# EAGLE design um66t (EAGLE 9.3.0)
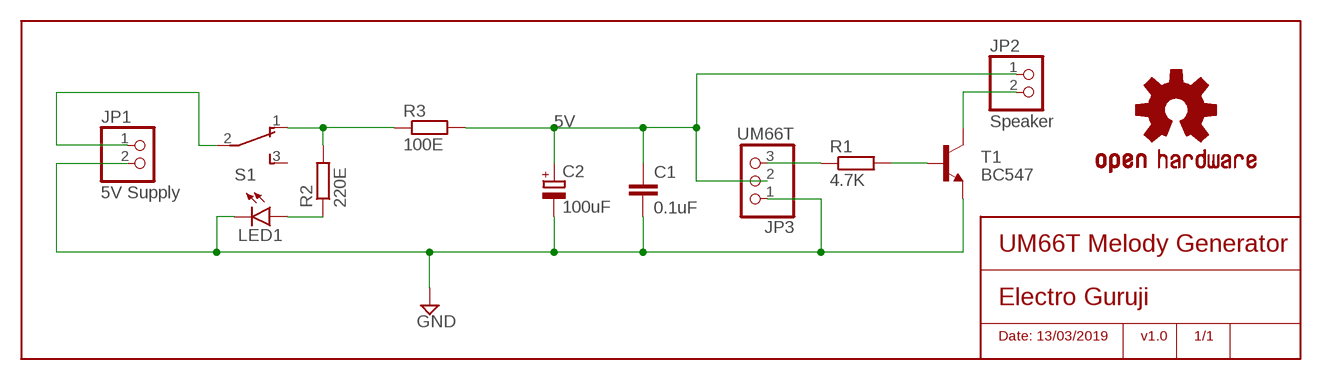
[diagram p0: schematic, sheet 1]

## Parts
C1  0.1uF  C-EU025-024X044  [C025-024X044]
C2  100uF  CPOL-EUE5-5  [E5-5]
JP1  5V Supply  PINHD-1X2  [1X02]
JP2  Speaker  PINHD-1X2  [1X02]
JP3  UM66T  PINHD-1X3  [1X03]
LED1  LED5MM  [LED5MM]
LOGO1  OSHW-LOGOM-COPPER  [OSHW-LOGO-M_COPPER]
R1  4.7K  R-EU_0204/5  [0204/5]
R2  220E  R-EU_0204/5  [0204/5]
R3  100E  R-EU_0204/5  [0204/5]
S1  SPDT  TL36YO  [TL3XYO]
T1  BC547  BC237-NPN-TO92-CBE  [TO92-CBE]

## Nets
5V: C1.1 C2.+ JP2.1 JP3.2 R3.2
9V: JP1.1 S1.2(P)
GND: C1.2 C2.- JP1.2 JP3.1 LED1.K(C) T1.E
N$1: LED1.A R2.1
N$2: R2.2 R3.1 S1.1(O)
N$5: JP3.3 R1.1
N$6: R1.2 T1.B
N$7: JP2.2 T1.C
Unconnected: S1.3(S)

## Notes on the sheet
- UM66T Melody Generator
- Electro Guruji
- Date: 13/03/2019 | v1.0 | 1/1

## Library data of the parts
C1 = resistor:C-EU: CAPACITOR, European symbol
C2 = resistor:CPOL-EU: POLARIZED CAPACITOR, European symbol
JP1 JP2 = pinhead:PINHD-1X2: PIN HEADER
JP3 = pinhead:PINHD-1X3: PIN HEADER
LED1 = led:LED: LED OSRAM: - CHIPLED LG R971, LG N971, LY N971, LG Q971, LY Q971, LO R971, LY R971 LH N974, LH R974 LS Q976, LO Q976, LY Q976 LO Q996 - Hyper CHIPLED LW Q18S LB Q993, LB Q99A, LB R99A - SideLED LS A670, LO A670, LY A670, LG A670, LP A670 LB A673, LV A673, LT A673, LW A673 LH A674 LY A675 LS A676, LA A676, LO A676, LY A676, LW A676 LS A679, LY A679, LG A679 - Hyper Micro SIDELED® LS Y876, LA Y876, LO Y876, LY Y876 LT Y87S - SmartLED LW L88C, LW L88S LB L89C, LB L89S, LG L890 LS L89K, LO L89K, LY L89K LS L896, LA L896, LO L896, LY L896 - TOPLED LS T670, LO T670, LY T670, LG T670, LP T670 LSG T670, LSP T670, LSY T670, LOP T670, LYG T670 LG T671, LOG T671, LSG T671 LB T673, LV T673, LT T673, LW T673 LH T674 LS T676, LA T676, LO T676, LY T676, LB T676, LH T676, LSB T676, LW T676 LB T67C, LV T67C, LT T67C, LS T67K, LO T67K, LY T67K, LW E67C LS E67B, LA E67B, LO E67B, LY E67B, LB E67C, LV E67C, LT E67C LW T67C LS T679, LY T679, LG T679 LS T770, LO T770, LY T770, LG T770, LP T770 LB T773, LV T773, LT T773, LW T773 LH T774 LS E675, LA E675, LY E675, LS T675 LS T776, LA T776, LO T776, LY T776, LB T776 LHGB T686 LT T68C, LB T68C - Hyper Mini TOPLED® LB M676 - Mini TOPLED Santana® LG M470 LS M47K, LO M47K, LY M47K Source: http://www.osram.convergy.de LUXEON: - LUMILED® LXK2-PW12-R00, LXK2-PW12-S00, LXK2-PW14-U00, LXK2-PW14-V00 LXK2-PM12-R00, LXK2-PM12-S00, LXK2-PM14-U00 LXK2-PE12-Q00, LXK2-PE12-R00, LXK2-PE12-S00, LXK2-PE14-T00, LXK2-PE14-U00 LXK2-PB12-K00, LXK2-PB12-L00, LXK2-PB12-M00, LXK2-PB14-N00, LXK2-PB14-P00, LXK2-PB14-Q00 LXK2-PR12-L00, LXK2-PR12-M00, LXK2-PR14-Q00, LXK2-PR14-R00 LXK2-PD12-Q00, LXK2-PD12-R00, LXK2-PD12-S00 LXK2-PH12-R00, LXK2-PH12-S00 LXK2-PL12-P00, LXK2-PL12-Q00, LXK2-PL12-R00 Source: www.luxeon.com KINGBRIGHT: KA-3528ASYC Source: www.kingbright.com
LOGO1 = SparkFun-Aesthetics:OSHW-LOGO: Open-Source Hardware (OSHW) Logo This logo indicates the piece of hardware it is found on incorporates a OSHW license and/or adheres to the definition of open source hardware found here: http://freedomdefined.org/OSHW
R1-R3 = resistor:R-EU_: RESISTOR, European symbol
S1 = switch:TL36YO: TINY SWITCH ON - ON Source: http://www2.produktinfo.conrad.com/datenblaetter/700000-724999/705152-da-01-de-Subminiaturschalter_TL_36YO.pdf
T1 = transistor:*-NPN-: NPN Transistror BF959 corrected 2008.03.06

## Board
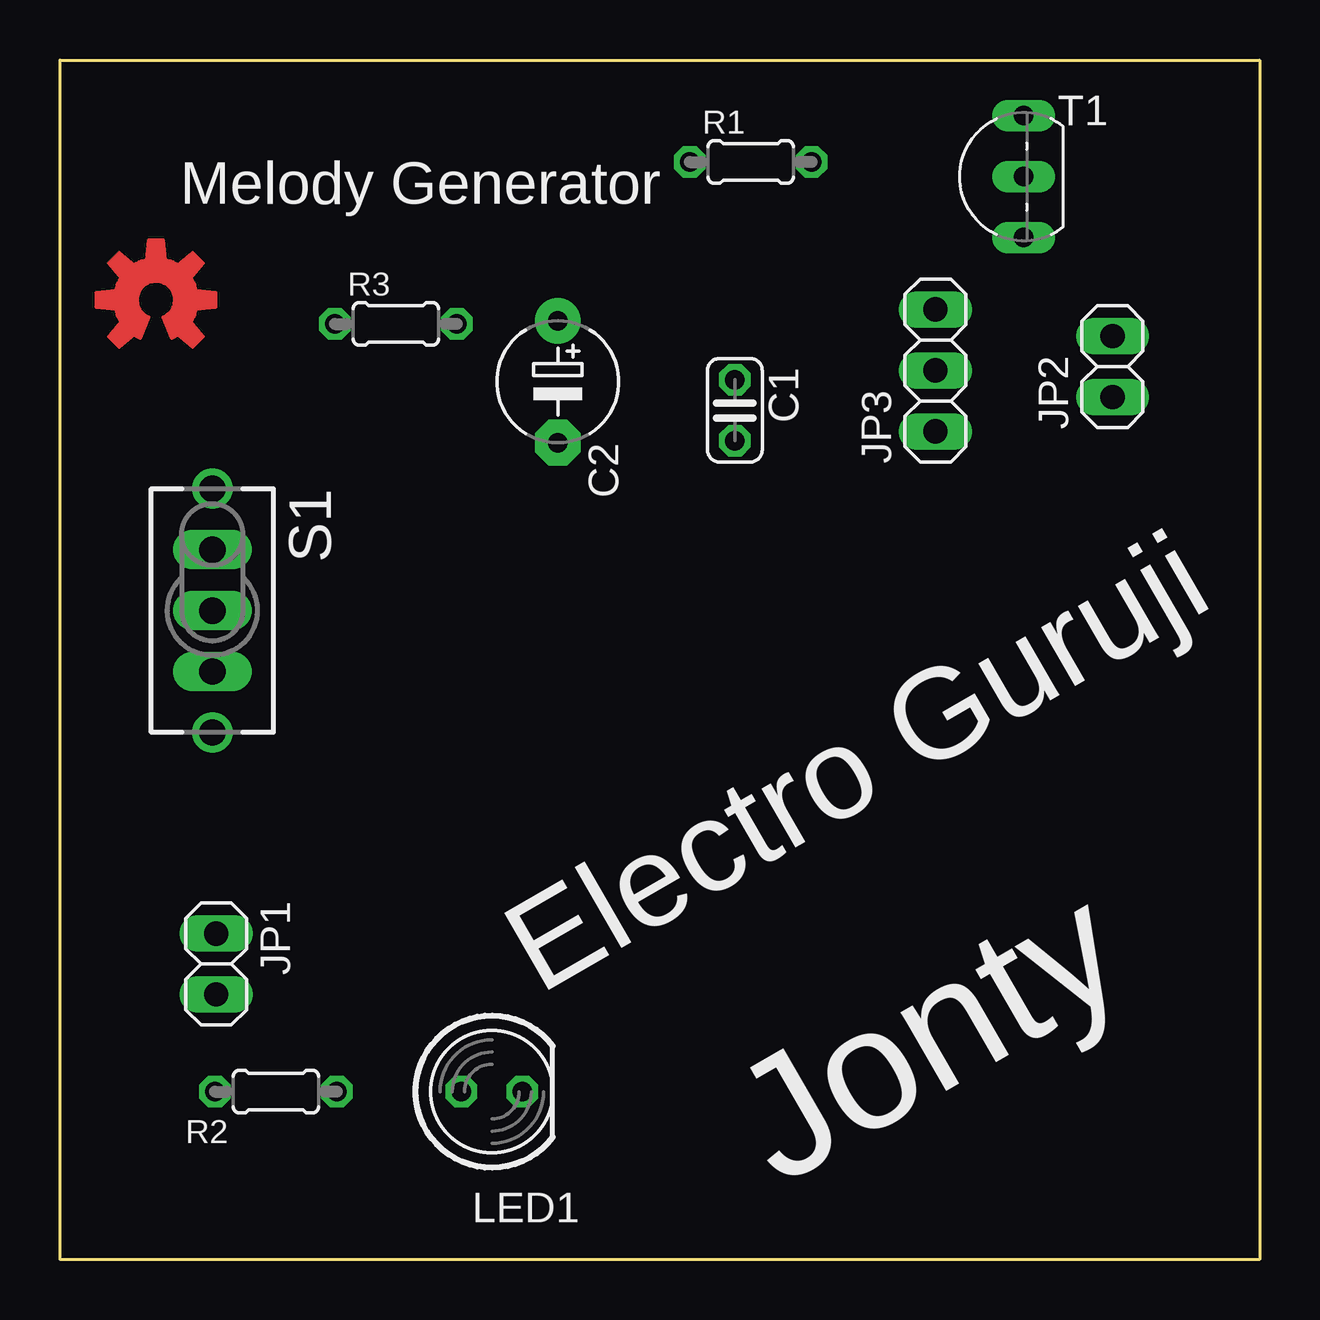
[diagram p1: board, top side]
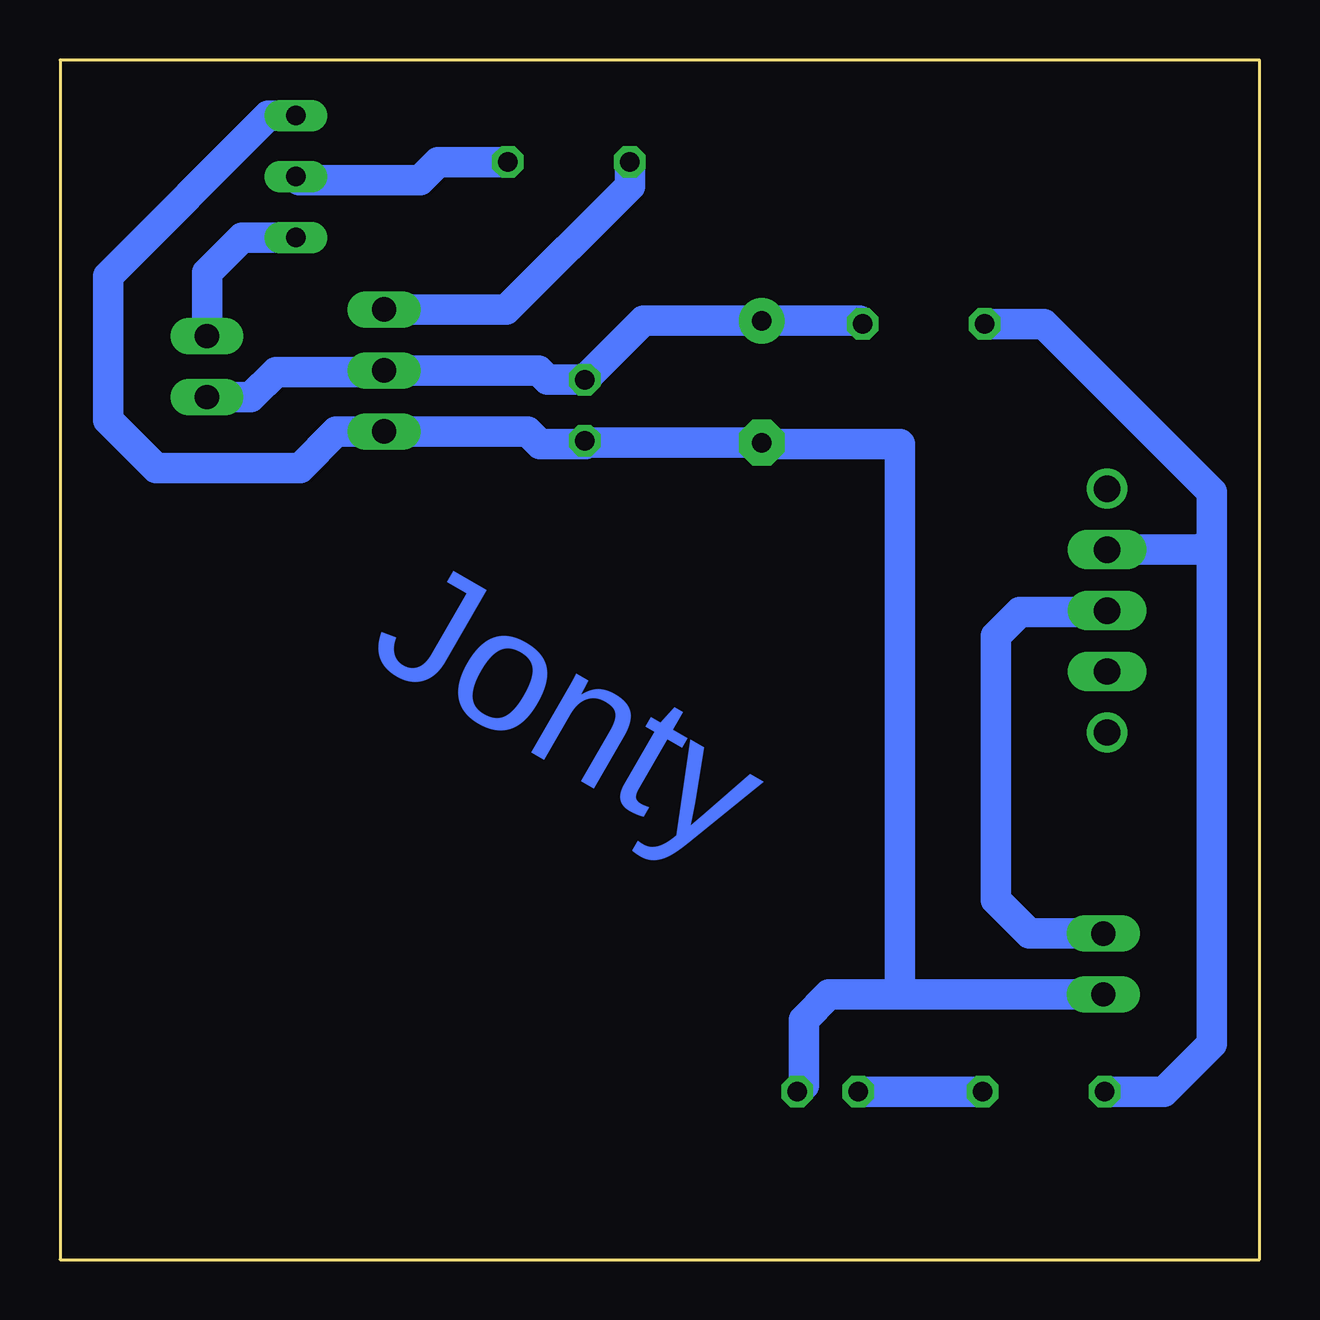
[diagram p2: board, bottom side, seen from below]

Size 50 x 50 mm. Coordinates in mm from the lower left corner, seen from the top.
Outline: 0,50 50,50 50,0 0,0 0,50
Copper layers (1*16): Top 0.035mm / dielectric 1.5mm / Bottom 0.035mm
Design rules "default": minimum track width 6mil, minimum drill 0.35mm, track to track 6mil, track to pad 6mil, pad to pad 6mil, via to via 6mil, smd to smd 6mil, copper to edge 40mil, drill to drill 6mil, minimum pad ring 10mil, minimum via ring 8mil, stop-mask expansion 4mil, vias tented up to drill 0mil, thermal gap 10mil

### Footprints (pad centres in the part's own frame; a part is rotated, then mirrored left to right if it is on the bottom)
C025-024X044 = drill 0.813 octagon: 1 -1.27,0; 2 1.27,0
E5-5 = drill 0.813 pad 1.905: + -2.54,0 | drill 0.813 pad 1.905 octagon: - 2.54,0
1X02 = drill 1.016 long: 1 -1.27,0; 2 1.27,0
1X03 = drill 1.016 long: 1 -2.54,0; 2 0,0; 3 2.54,0
LED5MM = drill 0.813 octagon: A -1.27,0; K 1.27,0
0204/5 = drill 0.813 octagon: 1 -2.54,0; 2 2.54,0
TL3XYO = drill 1.1 pad 1.422 long: 1 -2.54,0; 2 0,0; 3 2.54,0 | drill 1.1 pad 1.676: M1 -5.08,0; M2 5.08,0
TO92-CBE = drill 0.813 long: B 0,0; C -2.54,0; E 2.54,0

### Placement (x,y rotation side)
C1  28.13,35.4 270 top
C2  20.75,36.59 270 top
JP1  6.51,12.32 270 top
JP2  43.87,37.22 90 top
JP3  36.49,37.06 90 top
LED1  18,7 0 top
LOGO1  4,40 0 top
R1  28.79,45.75 0 top
R2  9,7 180 top
R3  14,39 0 top
S1  6.35,27.05 270 top
T1  40.17,45.14 90 top

### Tracks (layer width: path | path; a pad name or v marks a point on that pad's centre or on a via)
5V
  Bottom 1.27: 20.53,39.35 C2.+ | C2.+ 25.67,39.13 C1.1 29.67,36.67 30.06,37.06 JP3.2 36.55,37 41,37 42.05,35.95 JP2.1 | C2.+ 16.67,39.13 R3.2
9V
  Bottom 1.27: S1.2 6.4,27 10,27 11,26 11,15 9.59,13.59 JP1.1
GND
  Bottom 1.27: 28.05,34.05 C2.- 20.7,34 15,34 15,11.05 | 28.05,34.05 C1.2 | 28.05,34.05 28.1,34 30,34 30.52,34.52 JP3.1 38.48,34.52 40,33 46,33 48,35 48,41 41.32,47.68 T1.E | LED1.K 19,7.27 19,10 17.95,11.05 15,11.05 | 15,11.05 JP1.2
N$1
  Bottom 1.27: R2.1 LED1.A
N$2
  Bottom 1.27: R2.2 4,7 2,9 2,30 | 2,30 2,32 9,39 R3.1 | S1.1 2.41,29.59 2,30
N$5
  Bottom 1.27: R1.1 26.25,44.75 31.4,39.6 JP3.3
N$6
  Bottom 1.27: R1.2 34.25,45.75 35,45 40.03,45 T1.B
N$7
  Bottom 1.27: T1.C 42.4,42.6 43.87,41.13 JP2.2

### Text on the board
Bottom: Jonty
tPlace: Melody Generator | Electro Guruji | Jonty